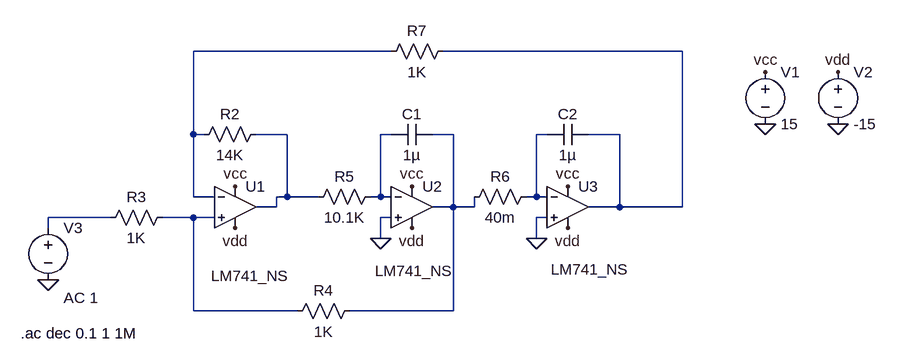
[diagram p0: schematic Draft1.asc]
Draft1.asc, the LTspice schematic file:
Version 4
SHEET 1 1076 680
WIRE 320 -80 16 -80
WIRE 768 -80 400 -80
WIRE 16 48 16 -80
WIRE 32 48 16 48
WIRE 160 48 112 48
WIRE 320 48 304 48
WIRE 416 48 384 48
WIRE 560 48 544 48
WIRE 672 48 624 48
WIRE 16 144 16 48
WIRE 48 144 16 144
WIRE 160 144 160 48
WIRE 160 144 144 144
WIRE 208 144 160 144
WIRE 304 144 304 48
WIRE 304 144 288 144
WIRE 320 144 304 144
WIRE 544 144 544 48
WIRE 544 144 528 144
WIRE 560 144 544 144
WIRE 144 160 144 144
WIRE 144 160 112 160
WIRE 416 160 416 48
WIRE 416 160 384 160
WIRE 448 160 448 144
WIRE 448 160 416 160
WIRE 672 160 672 48
WIRE 672 160 624 160
WIRE 768 160 768 -80
WIRE 768 160 672 160
WIRE -112 176 -208 176
WIRE 16 176 -32 176
WIRE 48 176 16 176
WIRE 320 176 304 176
WIRE 560 176 544 176
WIRE -208 192 -208 176
WIRE 304 208 304 176
WIRE 544 208 544 176
WIRE 16 320 16 176
WIRE 176 320 16 320
WIRE 416 320 416 160
WIRE 416 320 256 320
FLAG 896 32 0
FLAG 1008 32 0
FLAG 896 -48 vcc
FLAG 592 128 vcc
FLAG 352 128 vcc
FLAG 80 128 vcc
FLAG 1008 -48 vdd
FLAG 592 192 vdd
FLAG 352 192 vdd
FLAG 80 192 vdd
FLAG -208 272 0
FLAG 304 208 0
FLAG 544 208 0
SYMBOL AutoGenerated\\LM741_NS 80 96 R0
WINDOW 3 -37 170 Left 2
SYMATTR InstName U1
SYMBOL AutoGenerated\\LM741_NS 352 96 R0
WINDOW 3 -57 162 Left 2
SYMATTR InstName U2
SYMBOL AutoGenerated\\LM741_NS 592 96 R0
WINDOW 3 -26 160 Left 2
SYMATTR InstName U3
SYMBOL res 416 -96 R90
WINDOW 0 0 56 VBottom 2
WINDOW 3 32 56 VTop 2
SYMATTR InstName R7
SYMATTR Value 1K
SYMBOL res 128 32 R90
WINDOW 0 0 56 VBottom 2
WINDOW 3 32 56 VTop 2
SYMATTR InstName R2
SYMATTR Value 14K
SYMBOL res -16 160 R90
WINDOW 0 0 56 VBottom 2
WINDOW 3 32 56 VTop 2
SYMATTR InstName R3
SYMATTR Value 1K
SYMBOL res 272 304 R90
WINDOW 0 0 56 VBottom 2
WINDOW 3 32 56 VTop 2
SYMATTR InstName R4
SYMATTR Value 1K
SYMBOL res 304 128 R90
WINDOW 0 0 56 VBottom 2
WINDOW 3 32 56 VTop 2
SYMATTR InstName R5
SYMATTR Value 10.1K
SYMBOL res 544 128 R90
WINDOW 0 0 56 VBottom 2
WINDOW 3 32 56 VTop 2
SYMATTR InstName R6
SYMATTR Value 40m
SYMBOL cap 384 32 R90
WINDOW 0 0 32 VBottom 2
WINDOW 3 32 32 VTop 2
SYMATTR InstName C1
SYMATTR Value 1µ
SYMBOL cap 624 32 R90
WINDOW 0 0 32 VBottom 2
WINDOW 3 32 32 VTop 2
SYMATTR InstName C2
SYMATTR Value 1µ
SYMBOL voltage 896 -64 R0
WINDOW 123 0 0 Left 0
WINDOW 39 0 0 Left 0
SYMATTR InstName V1
SYMATTR Value 15
SYMBOL voltage 1008 -64 R0
WINDOW 123 0 0 Left 0
WINDOW 39 0 0 Left 0
SYMATTR InstName V2
SYMATTR Value -15
SYMBOL voltage -208 176 R0
WINDOW 123 24 124 Left 2
WINDOW 39 0 0 Left 0
SYMATTR InstName V3
SYMATTR Value ""
SYMATTR Value2 AC 1
TEXT -250 354 Left 2 !.ac dec 0.1 1 1M

The netlist it stands for:
* Draft1.asc
* U1: LM741_NS (symbol AutoGenerated\LM741_NS not available, pins judged from their places): In+=N008 In-=N001 V+=vcc V-=vdd OUT=N003
* U2: LM741_NS (symbol AutoGenerated\LM741_NS not available, pins judged from their places): In+=0 In-=N004 V+=vcc V-=vdd OUT=N005
* U3: LM741_NS (symbol AutoGenerated\LM741_NS not available, pins judged from their places): In+=0 In-=N006 V+=vcc V-=vdd OUT=N002
R7 N002 N001 1K
R2 N003 N001 14K
R3 N008 N007 1K
R4 N005 N008 1K
R5 N004 N003 10.1K
R6 N006 N005 40m
C1 N005 N004 1µ
C2 N002 N006 1µ
V1 vcc 0 15
V2 vdd 0 -15
V3 N007 0 AC 1
.ac dec 0.1 1 1M
.backanno
.end